# Altium schematic sheet Sheet1.SchDoc
size A; SheetNumber: 1; SheetTotal: 1
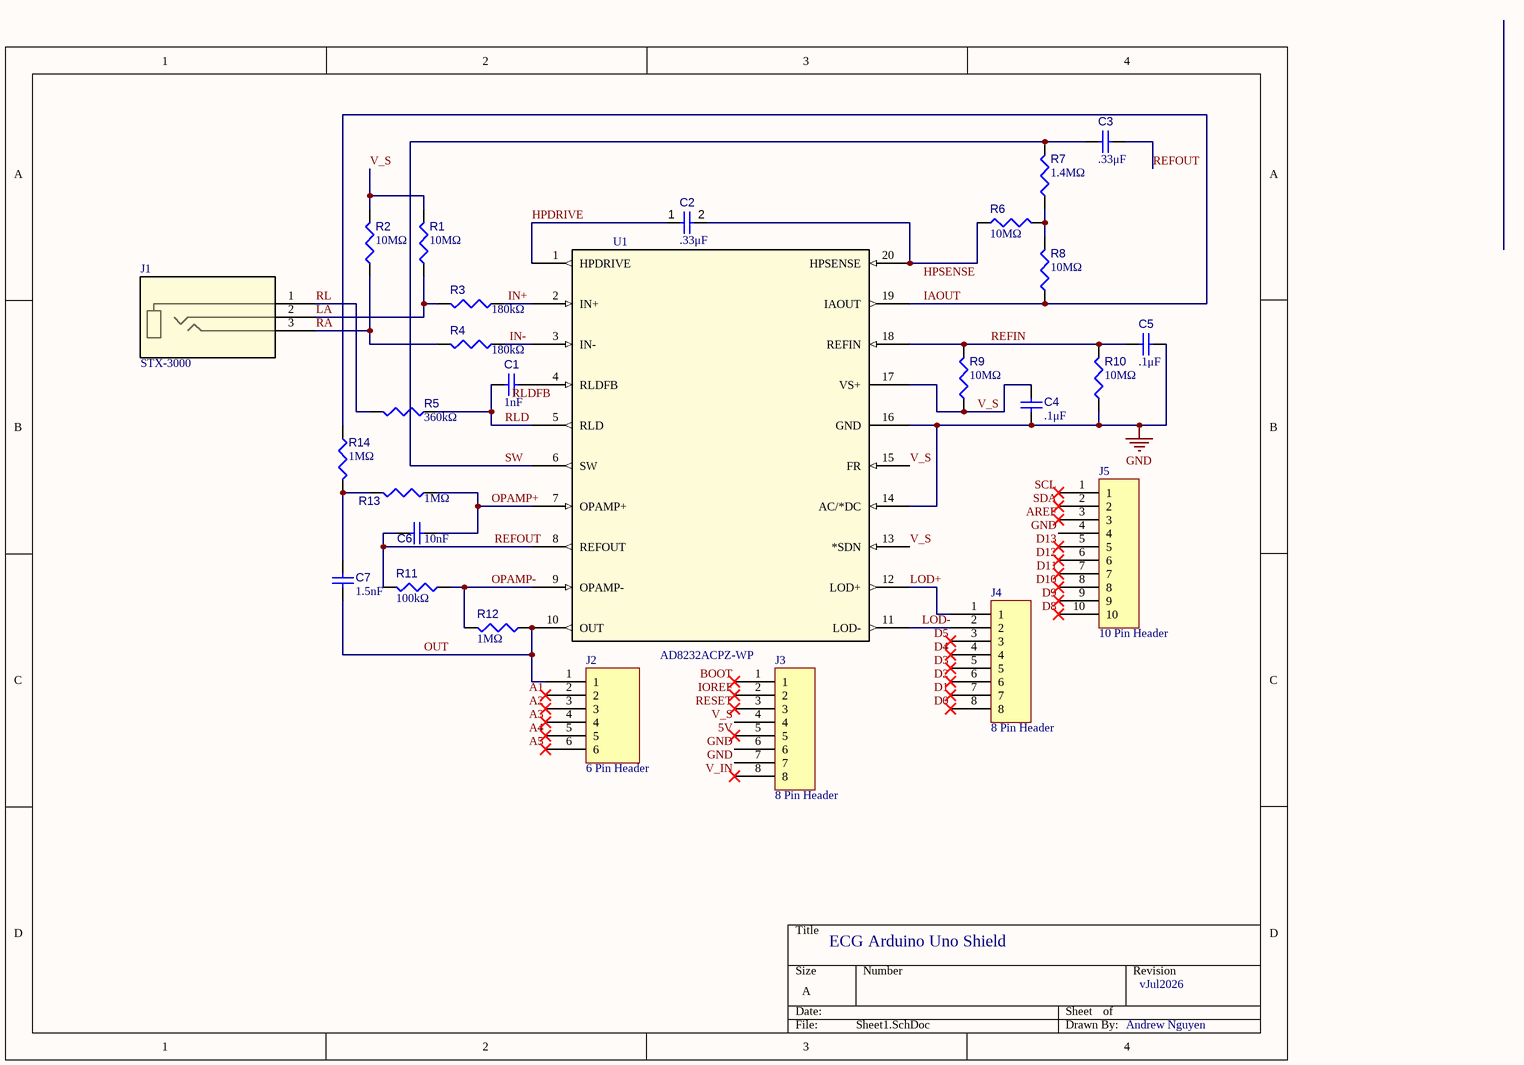
[diagram p0: Sheet1.SchDoc]

## Parts
C1  value 1nF  [CAPC0402(1005)33_L]
C2  value .33μF  [CAPC0402(1005)33_L]
C3  value .33μF  [CAPC0402(1005)33_L]
C4  value .1μF  [CAPC0402(1005)33_L]
C5  value .1μF  [CAPC0402(1005)33_L]  (hidden comment: Capacitor 1nF +/-20% 50V 0402)
C6  value 10nF  [CAPC0402(1005)33_L]  (hidden comment: Capacitor 1nF +/-20% 50V 0402)
C7  value 1.5nF  [CAPC0402(1005)33_L]  (hidden comment: Capacitor 1nF +/-20% 50V 0402)
J1  STX-3000  [STX-3000_KYC]
J2  6 Pin Header  [6 Pin Header-Footprint-1]
J3  8 Pin Header  [8 Pin Header-Footprint-1]
J4  8 Pin Header  [8 Pin Header-Footprint-1]
J5  10 Pin Header  [10 Pin Header-Footprint-1]
R1  value 10MΩ  [RESC0402(1005)_L]
R2  value 10MΩ  [RESC0402(1005)_L]
R3  value 180kΩ  [RESC0402(1005)_L]
R4  value 180kΩ  [RESC0402(1005)_L]
R5  value 360kΩ  [RESC0402(1005)_L]
R6  value 10MΩ  [RESC0402(1005)_L]  (hidden comment: VISHAY CRCW040210M0FKED)
R7  value 1.4MΩ  [RESC0402(1005)_L]
R8  value 10MΩ  [RESC0402(1005)_L]  (hidden comment: VISHAY CRCW040210M0FKED)
R9  value 10MΩ  [RESC0402(1005)_L]
R10  value 10MΩ  [RESC0402(1005)_L]  (hidden comment: VISHAY CRCW040210M0FKED)
R11  value 100kΩ  [RESC0402(1005)_L]  (hidden comment: YAGEO RC0402FR-07100KL)
R12  value 1MΩ  [RESC0402(1005)_L]  (hidden comment: YAGEO RC0402FR-071ML)
R13  value 1MΩ  [RESC0402(1005)_L]
R14  value 1MΩ  [RESC0402(1005)_L]
U1  AD8232ACPZ-WP  [CP_20_10_ADI]

## Nets
GND: C4.2 C5.2 J3.6 J3.7 J5.4 R10.1 U1.14(AC/*DC) U1.16(GND)
5V: J3.5
A1: J2.2
A2: J2.3
A3: J2.4
A4: J2.5
A5: J2.6
AREF: J5.3
BOOT: J3.1
D0: J4.8
D1: J4.7
D2: J4.6
D3: J4.5
D4: J4.4
D5: J4.3
D8: J5.10
D9: J5.9
D10: J5.8
D11: J5.7
D12: J5.6
D13: J5.5
HPDRIVE: C2.1 U1.1(HPDRIVE)
HPSENSE: C2.2 R6.1 U1.20(HPSENSE)
IAOUT: R8.1 R14.1 U1.19(IAOUT)
IN+: R3.1 U1.2(IN+)
IN-: R4.1 U1.3(IN-)
IOREF: J3.2
LA: J1.2 R1.1 R3.2
LOD+: J4.1 U1.12(LOD+)
LOD-: J4.2 U1.11(LOD-)
OPAMP+: C6.2 R13.1 U1.7(OPAMP+)
OPAMP-: R11.1 R12.2 U1.9(OPAMP-)
OUT: C7.2 J2.1 R12.1 U1.10(OUT)
RA: J1.3 R2.1 R4.2
REFIN: C5.1 R9.2 R10.2 U1.18(REFIN)
REFOUT: C3.2 C6.1 R11.2 U1.8(REFOUT)
RESET: J3.3
RL: J1.1 R5.2
RLD: C1.1 R5.1 U1.5(RLD)
RLDFB: C1.2 U1.4(RLDFB)
SCL: J5.1
SDA: J5.2
SW: C3.1 R7.2 U1.6(SW)
V_IN: J3.8
V_S: C4.1 J3.4 R1.2 R2.2 R9.1 U1.13(*SDN) U1.15(FR) U1.17(VS+)
NetC7_1: C7.1 R13.2 R14.2
NetR6_2: R6.2 R7.1 R8.2

## Notes on the sheet
- ECG Arduino Uno Shield
- vJul2026
- Andrew Nguyen

## Library data of the parts
C1 = CMP-001-00066-3: CAP CER 1nF 50V C0G 0402; Tolerance: 10%; Case/Package: 0402; Pins: 2; Min Operating Temperature: -55°C; Max Operating Temperature: 85°C; Voltage Rating: 50V; Mounting Technology: SMT
C2 C3 = CMP-001-00066-3: CAP CER 330nF 10V X7R 0402; Tolerance: 10%; Voltage Rating: 50V; Case/Package: 0402; Pins: 2; Min Operating Temperature: -55°C; Max Operating Temperature: 85°C; Mounting Technology: SMT
C4 = CMP-001-00066-3: CAP CER 100nF 16V X7R 0402; Tolerance: 10%; Voltage Rating: 50V; Case/Package: 0402; Pins: 2; Min Operating Temperature: -55°C; Max Operating Temperature: 85°C; Mounting Technology: SMT
C5 = CMP-001-00066-3: CAP CER 100nF 16V X7R 0402; Tolerance: 10%; Case/Package: 0402; Pins: 2; Min Operating Temperature: -55°C; Max Operating Temperature: 85°C; Voltage Rating: 50V; Mounting Technology: SMT
C6 = CMP-001-00066-3: CAP CER 10nF 50V X7R 0402; Tolerance: 10%; Case/Package: 0402; Pins: 2; Min Operating Temperature: -55°C; Max Operating Temperature: 85°C; Voltage Rating: 50V; Mounting Technology: SMT
C7 = CMP-001-00066-3: CAP CER 1.5nF 50V X7R 0402; Tolerance: 10%; Case/Package: 0402; Pins: 2; Min Operating Temperature: -55°C; Max Operating Temperature: 85°C; Voltage Rating: 50V; Mounting Technology: SMT
J1 = STX-3000: 3.50mm (0.141", 1/8", Mini Plug) - Headphone Phone Jack Stereo (3 Conductor, TRS) Connector Kinked Pin; Manufacturer_Name: KYCON, INC.; Copyright: Copyright (C) 2025 Ultra Librarian. All rights reserved.; Manufacturer_Part_Number: STX-3000; RefDes: RefDes; Type: Type
J2 = CMP-002-00075-2: 1x6 Header
J3 J4 = CMP-002-00076-2: 1x8 Header
J5 = CMP-002-00077-2: 1x10 Header
R1 R2 R6 R8-R10 = CMP-009-00169-3: RES 10MΩ ±1% 62.5mW 0402; Power: 63mW; Tolerance: 1%; Min Operating Temperature: -55°C; Max Operating Temperature: 155°C; Pins: 2; Case/Package: 0402
R3 R4 = CMP-009-00169-3: RES 180kΩ ±1% 62.5mW 0402; Power: 63mW; Tolerance: 1%; Min Operating Temperature: -55°C; Max Operating Temperature: 155°C; Pins: 2; Case/Package: 0402
R5 = CMP-009-00169-3: RES 360kΩ ±1% 62.5mW 0402; Power: 63mW; Tolerance: 1%; Min Operating Temperature: -55°C; Max Operating Temperature: 155°C; Pins: 2; Case/Package: 0402
R7 = CMP-009-00169-3: RES 1.4MΩ ±1% 62.5mW 0402; Power: 63mW; Tolerance: 1%; Min Operating Temperature: -55°C; Max Operating Temperature: 155°C; Pins: 2; Case/Package: 0402
R11 = CMP-009-00169-3: RES 100kΩ ±1% 62.5mW 0402; Power: 63mW; Tolerance: 1%; Min Operating Temperature: -55°C; Max Operating Temperature: 155°C; Pins: 2; Case/Package: 0402
R12-R14 = CMP-009-00169-3: RES 1MΩ ±1% 62.5mW 0402; Power: 63mW; Tolerance: 1%; Min Operating Temperature: -55°C; Max Operating Temperature: 155°C; Pins: 2; Case/Package: 0402
U1 = AD8232ACPZ-WP: Single-Lead, Heart Rate Monitor Front End; Manufacturer_Name: Analog Devices Inc; Copyright: Copyright (C) 2025 Ultra Librarian. All rights reserved.; Manufacturer_Part_Number: AD8232ACPZ-WP; RefDes: RefDes; Type: Type